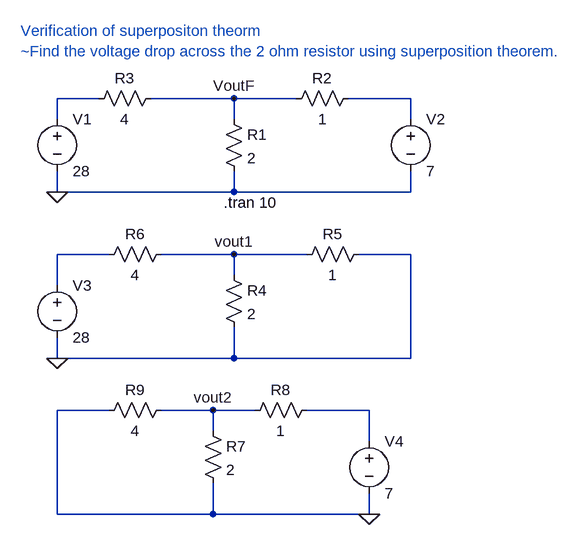
[diagram p0: schematic Lab1_ques1.asc]
Lab1_ques1.asc, the LTspice schematic file:
Version 4
SHEET 1 1324 800
WIRE 176 144 112 144
WIRE 384 144 256 144
WIRE 480 144 384 144
WIRE 656 144 560 144
WIRE 112 176 112 144
WIRE 384 176 384 144
WIRE 656 176 656 144
WIRE 112 288 112 256
WIRE 384 288 384 256
WIRE 384 288 112 288
WIRE 656 288 656 256
WIRE 656 288 384 288
WIRE 192 384 112 384
WIRE 384 384 272 384
WIRE 496 384 384 384
WIRE 656 384 576 384
WIRE 384 416 384 384
WIRE 112 432 112 384
WIRE 112 544 112 512
WIRE 384 544 384 496
WIRE 384 544 112 544
WIRE 656 544 656 384
WIRE 656 544 384 544
WIRE 192 624 112 624
WIRE 352 624 272 624
WIRE 416 624 352 624
WIRE 592 624 496 624
WIRE 352 656 352 624
WIRE 592 672 592 624
WIRE 112 784 112 624
WIRE 352 784 352 736
WIRE 352 784 112 784
WIRE 592 784 592 752
WIRE 592 784 352 784
FLAG 112 288 0
FLAG 112 544 0
FLAG 592 784 0
FLAG 384 384 vout1
FLAG 352 624 vout2
FLAG 384 144 VoutF
SYMBOL res 368 160 R0
SYMATTR InstName R1
SYMATTR Value 2
SYMBOL res 576 128 R90
WINDOW 0 0 56 VBottom 2
WINDOW 3 32 56 VTop 2
SYMATTR InstName R2
SYMATTR Value 1
SYMBOL res 272 128 R90
WINDOW 0 0 56 VBottom 2
WINDOW 3 32 56 VTop 2
SYMATTR InstName R3
SYMATTR Value 4
SYMBOL voltage 112 160 R0
SYMATTR InstName V1
SYMATTR Value 28
SYMBOL voltage 656 160 R0
SYMATTR InstName V2
SYMATTR Value 7
SYMBOL res 368 400 R0
SYMATTR InstName R4
SYMATTR Value 2
SYMBOL res 592 368 R90
WINDOW 0 0 56 VBottom 2
WINDOW 3 32 56 VTop 2
SYMATTR InstName R5
SYMATTR Value 1
SYMBOL res 288 368 R90
WINDOW 0 0 56 VBottom 2
WINDOW 3 32 56 VTop 2
SYMATTR InstName R6
SYMATTR Value 4
SYMBOL voltage 112 416 R0
SYMATTR InstName V3
SYMATTR Value 28
SYMBOL Res 336 640 R0
SYMATTR InstName R7
SYMATTR Value 2
SYMBOL Res 512 608 R90
WINDOW 0 0 56 VBottom 2
WINDOW 3 32 56 VTop 2
SYMATTR InstName R8
SYMATTR Value 1
SYMBOL Res 288 608 R90
WINDOW 0 0 56 VBottom 2
WINDOW 3 32 56 VTop 2
SYMATTR InstName R9
SYMATTR Value 4
SYMBOL Voltage 592 656 R0
SYMATTR InstName V4
SYMATTR Value 7
TEXT 56 40 Left 2 ;Verification of superpositon theorm\n~Find the voltage drop across the 2 ohm resistor using superposition theorem.
TEXT 368 304 Left 2 !.tran 10

The netlist it stands for:
* Lab1_ques1.asc
R1 VoutF 0 2
R2 N002 VoutF 1
R3 VoutF N001 4
V1 N001 0 28
V2 N002 0 7
R4 vout1 0 2
R5 0 vout1 1
R6 vout1 N003 4
V3 N003 0 28
R7 vout2 0 2
R8 N004 vout2 1
R9 vout2 0 4
V4 N004 0 7
* Verification of superpositon theorm
* ~Find the voltage drop across the 2 ohm resistor using superposition theorem.
.tran 10
.backanno
.end